# EAGLE design dc_part (EAGLE 6.4)
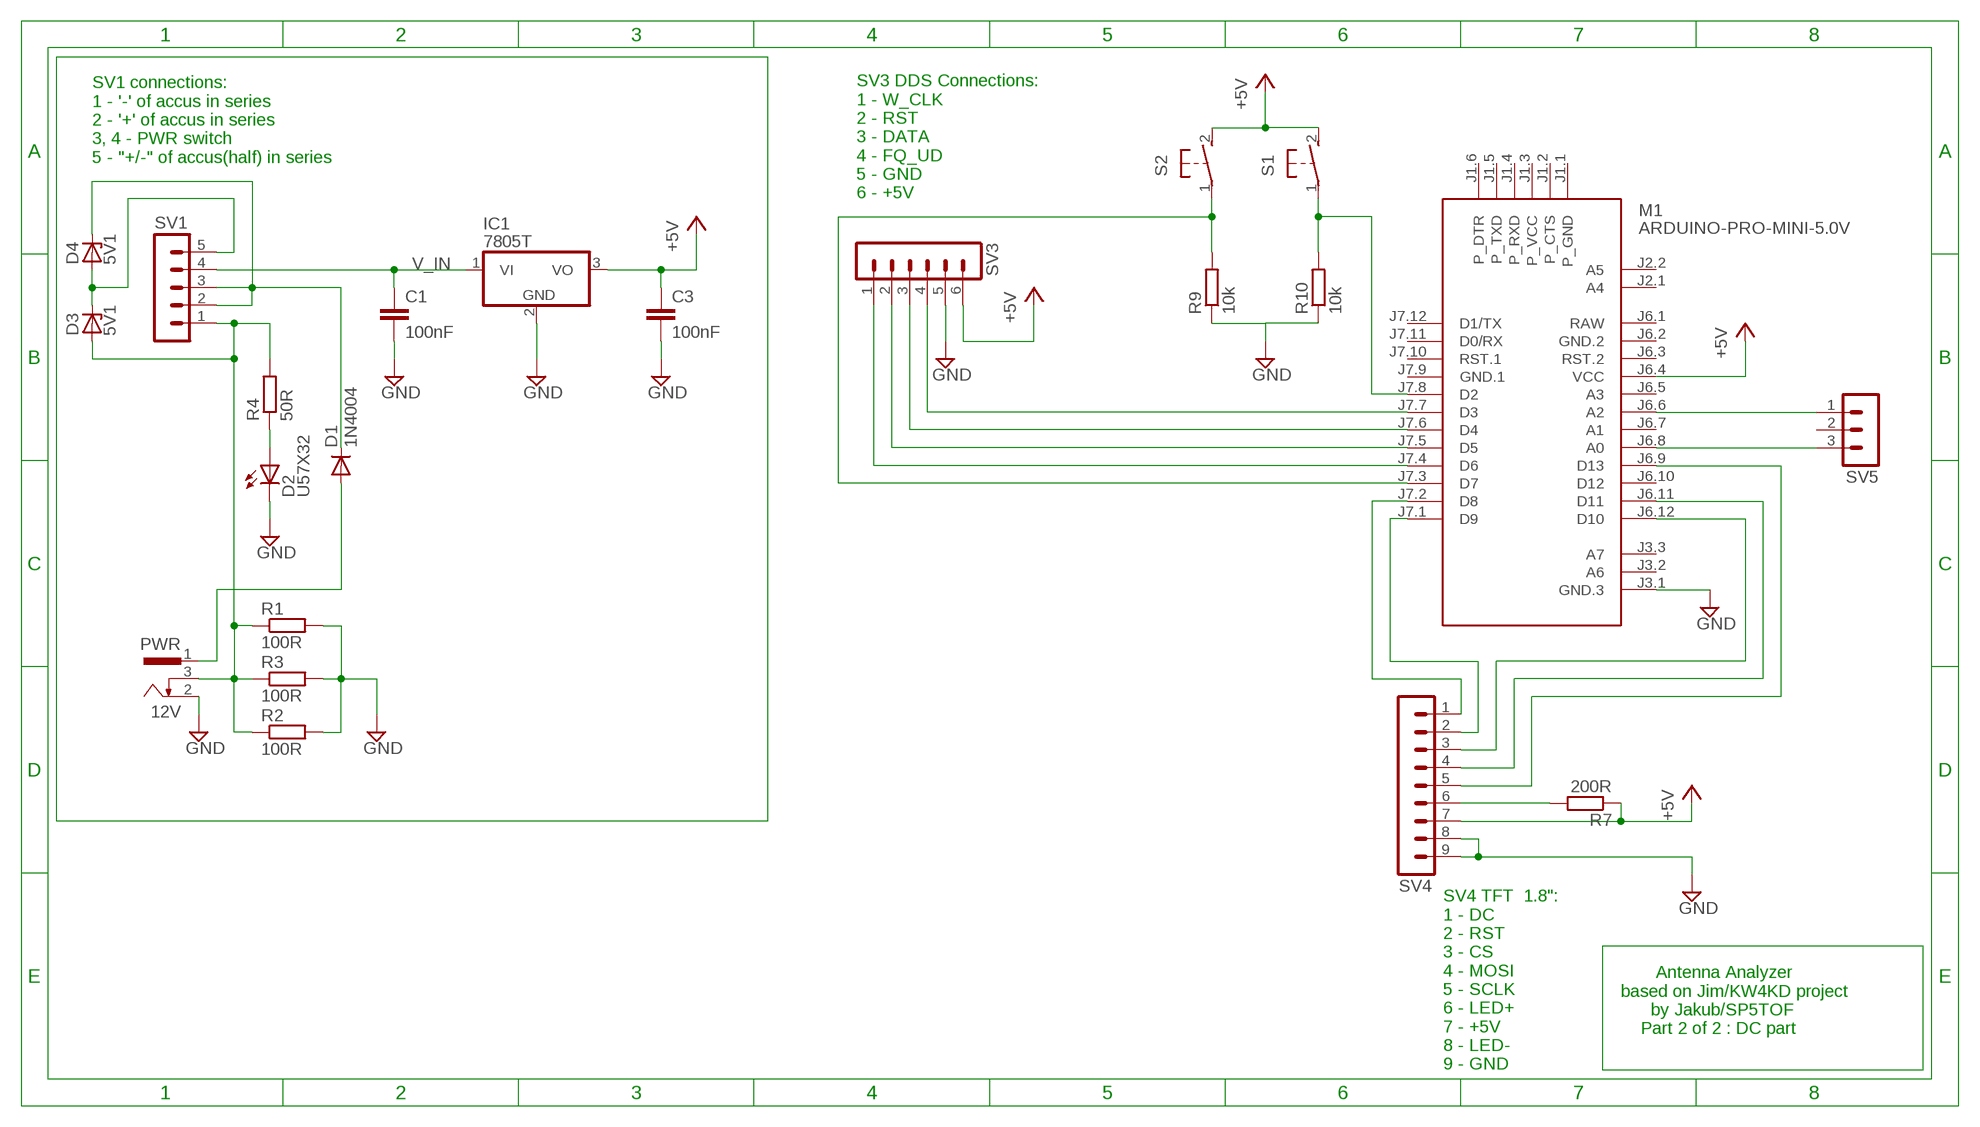
[diagram p0: schematic, sheet 1]

## Parts
C1  100nF  C-EU050-024X044  [C050-024X044]
C3  100nF  C-EU050-024X044  [C050-024X044]
D1  1N4004  [DO41-10]
D2  U57X32  [U57X32]
D3  5V1  ZENER-DIODEZD-5  [ZDIO-5]
D4  5V1  ZENER-DIODEZD-5  [ZDIO-5]
IC1  7805T  [TO220H]
M1  ARDUINO-PRO-MINI-5.0V  [ARDUINO-PRO-MINI]
PWR  12V  733980-62  [733980-62]
R1  100R  R-EU_0207/10  [0207/10]
R2  100R  R-EU_0207/10  [0207/10]
R3  100R  R-EU_0207/10  [0207/10]
R4  50R  R-EU_0207/10  [0207/10]
R7  200R  R-EU_0207/10  [0207/10]
R9  10k  R-EU_0207/10  [0207/10]
R10  10k  R-EU_0207/10  [0207/10]
S1  31-XX  [B3F-31XX]
S2  31-XX  [B3F-31XX]
SV1  MA05-1  [MA05-1]
SV3  MA06-1  [MA06-1]
SV4  MA09-1  [MA09-1]
SV5  MA03-1  [MA03-1]

## Nets
+5V: C3.1 IC1.3(VO) M1.J6.4(VCC) R7.1 S1.2(S) S2.2(S) SV3.6 SV4.7
ACCU+: D1.C D4.C SV1.2 SV1.3
ACCU-: D3.A PWR.3 R1.1 R2.1 R3.1 R4.2 SV1.1
GND: C1.2 C3.2 D2.K(C) IC1.2(GND) M1.J3.1(GND.3) PWR.2 R1.2 R2.2 R3.2 R9.1 R10.1 SV3.5 SV4.8 SV4.9
N$2: R7.2 SV4.6
N$3: D1.A PWR.1
N$8: M1.J7.2(D8) SV4.1
N$9: D2.A R4.1
N$10: D3.C D4.A SV1.5
N$16: M1.J7.4(D6) SV3.1
N$17: M1.J7.5(D5) SV3.2
N$18: M1.J7.6(D4) SV3.3
N$19: M1.J7.7(D3) SV3.4
N$20: M1.J7.1(D9) SV4.2
N$21: M1.J6.12(D10) SV4.3
N$22: M1.J6.11(D11) SV4.4
N$23: M1.J6.9(D13) SV4.5
N$24: M1.J6.6(A2) SV5.1
N$25: M1.J6.8(A0) SV5.3
N$27: M1.J7.8(D2) R10.2 S1.1(P)
N$29: M1.J7.3(D7) R9.2 S2.1(P)
V_IN: C1.1 IC1.1(VI) SV1.4
Unconnected: M1.J1.1(P_GND) M1.J1.2(P_CTS) M1.J1.3(P_VCC) M1.J1.4(P_RXD) M1.J1.5(P_TXD) M1.J1.6(P_DTR) M1.J2.1(A4) M1.J2.2(A5) M1.J3.2(A6) M1.J3.3(A7) M1.J6.3(RST.2) M1.J6.5(A3) M1.J6.7(A1) M1.J6.10(D12) M1.J7.10(RST.1) M1.J7.11(D0/RX) M1.J7.12(D1/TX) SV5.2

## Notes on the sheet
- SV1 connections:
  1 - '-' of accus in series
  2 - '+' of accus in series
  3, 4 - PWR switch
  5 - "+/-" of accus(half) in series
- SV3 DDS Connections:
  1 - W_CLK
  2 - RST
  3 - DATA
  4 - FQ_UD
  5 - GND
  6 - +5V
- Antenna Analyzer
  based on Jim/KW4KD project
        by Jakub/SP5TOF 
      Part 2 of 2 : DC part
- SV4 TFT  1.8":
  1 - DC
  2 - RST
  3 - CS
  4 - MOSI
  5 - SCLK
  6 - LED+
  7 - +5V
  8 - LED-
  9 - GND

## Power pins joined to a net without a drawn wire
GND.1: M1.J7.9(GND.1)
GND.2: M1.J6.2(GND.2)
RAW: M1.J6.1(RAW)

## Library data of the parts
C1 C3 = rcl:C-EU: CAPACITOR, European symbol
D1 = diode:1N4004: DIODE general purpose rectifier, 1 A
D2 = led:U57X32: LED rectangle, 5.7 x 3.2 mm
D3 D4 = diode:ZENER-DIODE: Z-Diode
IC1 = linear:78*: Positive VOLTAGE REGULATOR Source: http://cache.national.com/ds/LM/LM78L05.pdf http://www.fairchildsemi.com/ds/LM/LM7805.pdf
M1 = diy-modules:ARDUINO-PRO-MINI-*: Arduino Pro Mini
PWR = con-conrad:73398?: FEMALE PRINT CONNECTOR Niedervolt-Steckverbinder Distributor Conrad
R1-R4 R7 R9 R10 = rcl:R-EU_: RESISTOR, European symbol
S1 S2 = switch-omron:31-XX: OMRON SWITCH; MPN: B3F-3100; OC_FARNELL: 959704; OC_NEWARK: 36M3582
SV1 = con-lstb:MA05-1: PIN HEADER; OC_FARNELL: unknown; OC_NEWARK: unknown
SV3 = con-lstb:MA06-1: PIN HEADER; OC_FARNELL: unknown; OC_NEWARK: unknown
SV4 = con-lstb:MA09-1: PIN HEADER; OC_FARNELL: unknown; OC_NEWARK: unknown
SV5 = con-lstb:MA03-1: PIN HEADER; OC_FARNELL: unknown; OC_NEWARK: unknown

## Board
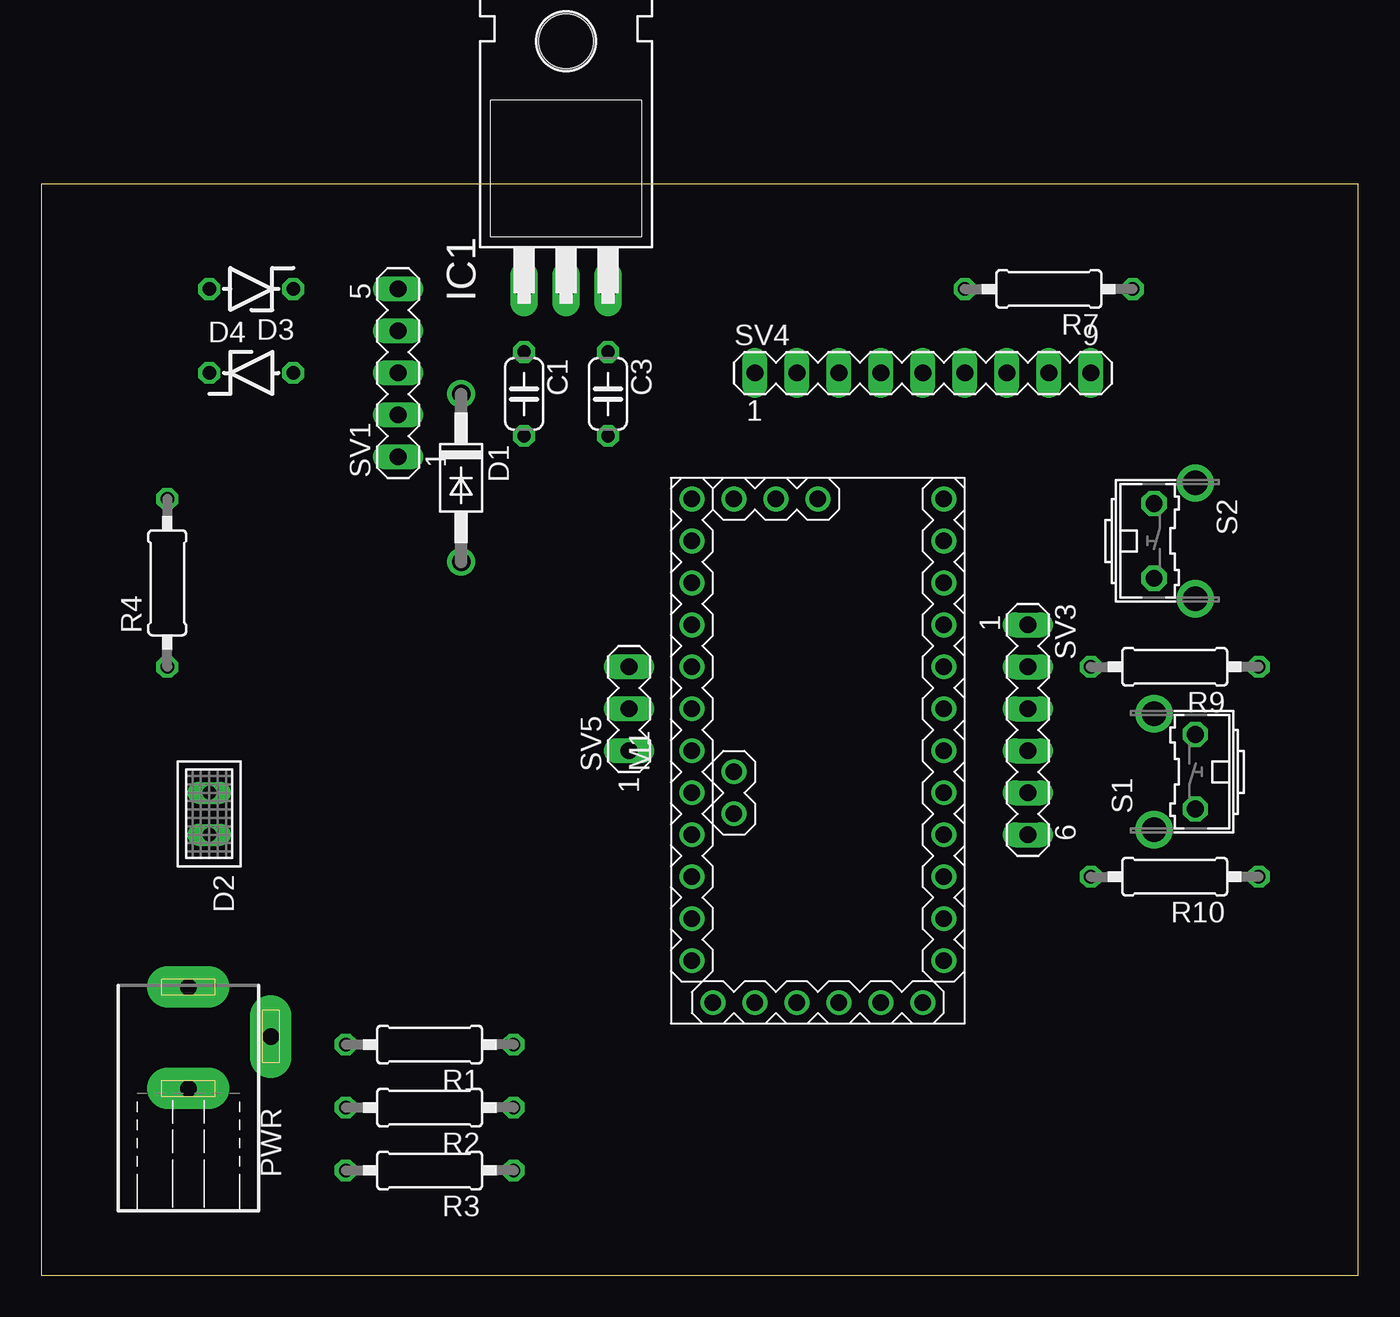
[diagram p1: board, top side]
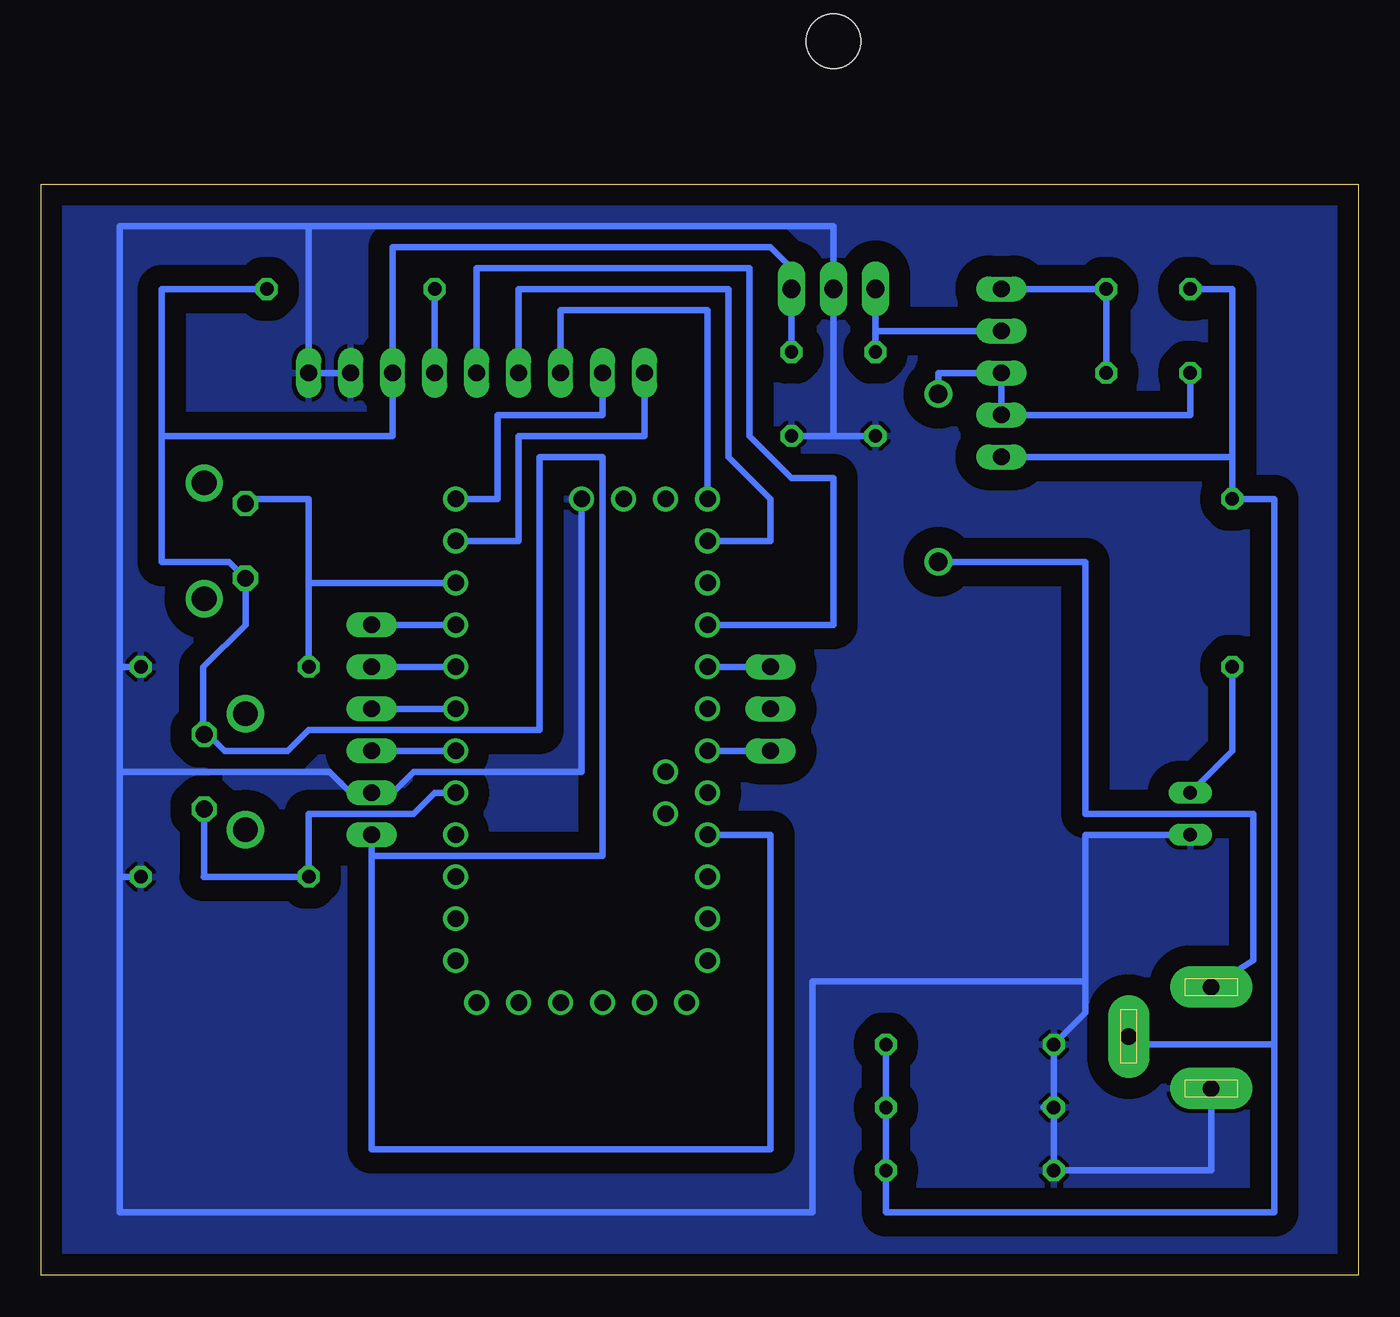
[diagram p2: board, bottom side, seen from below]

Size 79.68 x 66.03 mm. Coordinates in mm from the lower left corner, seen from the top.
Outline: 0,0 79.68,0 79.68,66.03 0,66.03 0,0
Copper layers (1*16): Top 0.035mm / dielectric 1.5mm / Bottom 0.035mm
Design rules "default": minimum track width 10mil, minimum drill 24mil, track to track 8mil, track to pad 8mil, pad to pad 8mil, via to via 8mil, smd to smd 8mil, copper to edge 40mil, drill to drill 8mil, minimum pad ring 10mil, minimum via ring 8mil, stop-mask expansion 4mil, vias tented up to drill 0mil, thermal gap 10mil

### Footprints (pad centres in the part's own frame; a part is rotated, then mirrored left to right if it is on the bottom)
C050-024X044 = drill 0.813 octagon: 1 -2.54,0; 2 2.54,0
DO41-10 = drill 1.118: A 5.08,0; C -5.08,0
U57X32 = drill 0.813 long: A -1.27,0; K 1.27,0
ZDIO-5 = drill 0.813 octagon: A 2.54,0; C -2.54,0
TO220H = drill 1.118 long: 1 -2.54,-10.16; 2 0,-10.16; 3 2.54,-10.16 | hole 3.302: 0,4.826
ARDUINO-PRO-MINI = drill 1: J1.1 -15.24,6.35; J1.2 -15.24,3.81; J1.3 -15.24,1.27; J1.4 -15.24,-1.27; J1.5 -15.24,-3.81; J1.6 -15.24,-6.35; J2.1 -1.27,5.08; J2.2 -3.81,5.08; J3.1 15.24,0; J3.2 15.24,2.54; J3.3 15.24,5.08; J6.1 -12.7,7.62; J6.2 -10.16,7.62; J6.3 -7.62,7.62; J6.4 -5.08,7.62; J6.5 -2.54,7.62; J6.6 0,7.62; J6.7 2.54,7.62; J6.8 5.08,7.62; J6.9 7.62,7.62; J6.10 10.16,7.62; J6.11 12.7,7.62; J6.12 15.24,7.62; J7.1 15.24,-7.62; J7.2 12.7,-7.62; J7.3 10.16,-7.62; J7.4 7.62,-7.62; J7.5 5.08,-7.62; J7.6 2.54,-7.62; J7.7 0,-7.62; J7.8 -2.54,-7.62; J7.9 -5.08,-7.62; J7.10 -7.62,-7.62; J7.11 -10.16,-7.62; J7.12 -12.7,-7.62
733980-62 = drill 1 pad 2.5 long: 1 0,8.57; 2 0,2.42; 3 5,5.57
0207/10 = drill 0.813 octagon: 1 -5.08,0; 2 5.08,0
B3F-31XX = drill 1.016 octagon: 1 -2.261,-1.245; 2 2.261,-1.245 | drill 1.499 pad 2.159: 3 -3.505,1.245; 4 3.505,1.245
MA05-1 = drill 1.016 long: 1 -5.08,0; 2 -2.54,0; 3 0,0; 4 2.54,0; 5 5.08,0
MA06-1 = drill 1.016 long: 1 -6.35,0; 2 -3.81,0; 3 -1.27,0; 4 1.27,0; 5 3.81,0; 6 6.35,0
MA09-1 = drill 1.016 long: 1 -10.16,0; 2 -7.62,0; 3 -5.08,0; 4 -2.54,0; 5 0,0; 6 2.54,0; 7 5.08,0; 8 7.62,0; 9 10.16,0
MA03-1 = drill 1.016 long: 1 -2.54,0; 2 0,0; 3 2.54,0

### Placement (x,y rotation side)
C1  29.21,53.34 270 top
C3  34.29,53.34 270 top
D1  25.4,48.26 270 top
D2  10.16,27.94 270 top
D3  12.7,59.69 180 top
D4  12.7,54.61 0 top
IC1  31.75,69.85 0 top
M1  46.99,31.75 90 top
PWR  8.89,8.89 0 top
R1  23.5,13.97 180 top
R2  23.5,10.16 180 top
R3  23.5,6.35 180 top
R4  7.62,41.91 90 top
R7  60.96,59.69 180 top
R9  68.58,36.83 180 top
R10  68.58,24.13 180 top
S1  68.58,30.48 90 top
S2  68.58,44.45 270 top
SV1  21.59,54.61 90 top
SV3  59.69,33.02 270 top
SV4  53.34,54.61 0 top
SV5  35.56,34.29 90 top

### Tracks (layer width: path | path; a pad name or v marks a point on that pad's centre or on a via)
+5V
  Bottom 0.406: C3.1 IC1.3 34.29,60.96 35.56,62.23 58.42,62.23 SV4.7 58.42,50.8 72.39,50.8 | SV3.6 59.69,25.4 | 59.69,25.4 59.69,7.62 35.56,7.62 35.56,26.67 M1.J6.4 | 72.39,50.8 72.39,43.18 68.33,43.18 S2.2 67.31,42.16 67.31,39.37 69.88,36.8 69.88,32.74 S1.2 69.57,32.74 68.58,31.75 64.77,31.75 63.5,33.02 49.53,33.02 49.53,49.53 45.72,49.53 45.72,25.4 59.69,25.4 | R7.1 72.39,59.69 72.39,50.8
ACCU+
  Bottom 0.406: D4.C 10.16,52.07 SV1.2 SV1.3 25.4,54.61 D1.C
ACCU-
  Bottom 0.406: D3.A 7.62,59.69 7.62,49.53 | 7.62,49.53 SV1.1 | 7.62,49.53 R4.2 5.08,46.99 5.08,13.97 | R1.1 R2.1 R3.1 28.57,3.81 5.08,3.81 5.08,13.97 | PWR.3 13.4,13.97 5.08,13.97
GND
  Bottom 0.406: PWR.2 8.89,6.35 R3.2 R2.2 | R2.2 R1.2 16.51,15.87 16.51,17.78 | 19.05,10.16 R2.2 | 31.75,50.8 IC1.2 31.75,63.5 63.5,63.5 | 31.75,50.8 C1.2 | C3.2 31.75,50.8 | D2.K 16.51,26.67 16.51,17.78 | 63.5,63.5 74.93,63.5 74.93,36.83 | 74.93,36.83 74.93,30.48 | 74.93,30.48 74.93,24.13 | 74.93,24.13 74.93,3.81 33.02,3.81 33.02,17.78 16.51,17.78 | 63.5,63.5 SV4.9 SV4.8 | R9.1 74.93,36.83 | R10.1 74.93,24.13 | 74.93,30.48 62.23,30.48 60.96,29.21 SV3.5 58.42,29.21 57.15,30.48 46.99,30.48 M1.J3.1
  pour Bottom (isolate 1.27): 0,66.04 80.01,66.04 80.01,0 0,0
N$2
  Bottom 0.406: SV4.6 R7.2
N$3
  Bottom 0.406: D1.A 16.51,43.18 16.51,27.94 6.35,27.94 6.35,19.05 PWR.1
N$8
  Bottom 0.406: SV4.1 43.18,50.8 50.8,50.8 50.8,44.45 M1.J7.2
N$9
  Bottom 0.406: D2.A 7.62,31.75 R4.1
N$10
  Bottom 0.406: SV1.5 D3.C D4.A
N$16
  Bottom 0.406: SV3.1 M1.J7.4
N$17
  Bottom 0.406: SV3.2 M1.J7.5
N$18
  Bottom 0.406: SV3.3 M1.J7.6
N$19
  Bottom 0.406: SV3.4 M1.J7.7
N$20
  Bottom 0.406: SV4.2 45.72,52.07 52.07,52.07 52.07,46.99 M1.J7.1
N$21
  Bottom 0.406: SV4.3 48.26,58.42 39.37,58.42 M1.J6.12
N$22
  Bottom 0.406: SV4.4 50.8,59.69 38.1,59.69 38.1,49.53 35.56,46.99 35.56,44.45 M1.J6.11
N$23
  Bottom 0.406: SV4.5 53.34,60.96 36.83,60.96 36.83,50.8 34.29,48.26 31.75,48.26 31.75,39.37 M1.J6.9
N$24
  Bottom 0.406: M1.J6.6 SV5.1
N$25
  Bottom 0.406: M1.J6.8 SV5.3
N$27
  Bottom 0.406: S1.1 69.83,24.16 69.85,24.13 R10.2 63.5,27.94 57.15,27.94 55.88,29.21 M1.J7.8
N$29
  Bottom 0.406: R9.2 63.5,41.91 | 63.5,41.91 M1.J7.3 | S2.1 67.33,46.99 63.5,46.99 63.5,41.91
V_IN
  Bottom 0.406: SV1.4 29.21,57.15 | 29.21,57.15 IC1.1 | C1.1 29.21,57.15